# Altium schematic sheet Main.SchDoc
size A3; SheetNumber: 1; SheetTotal: 1
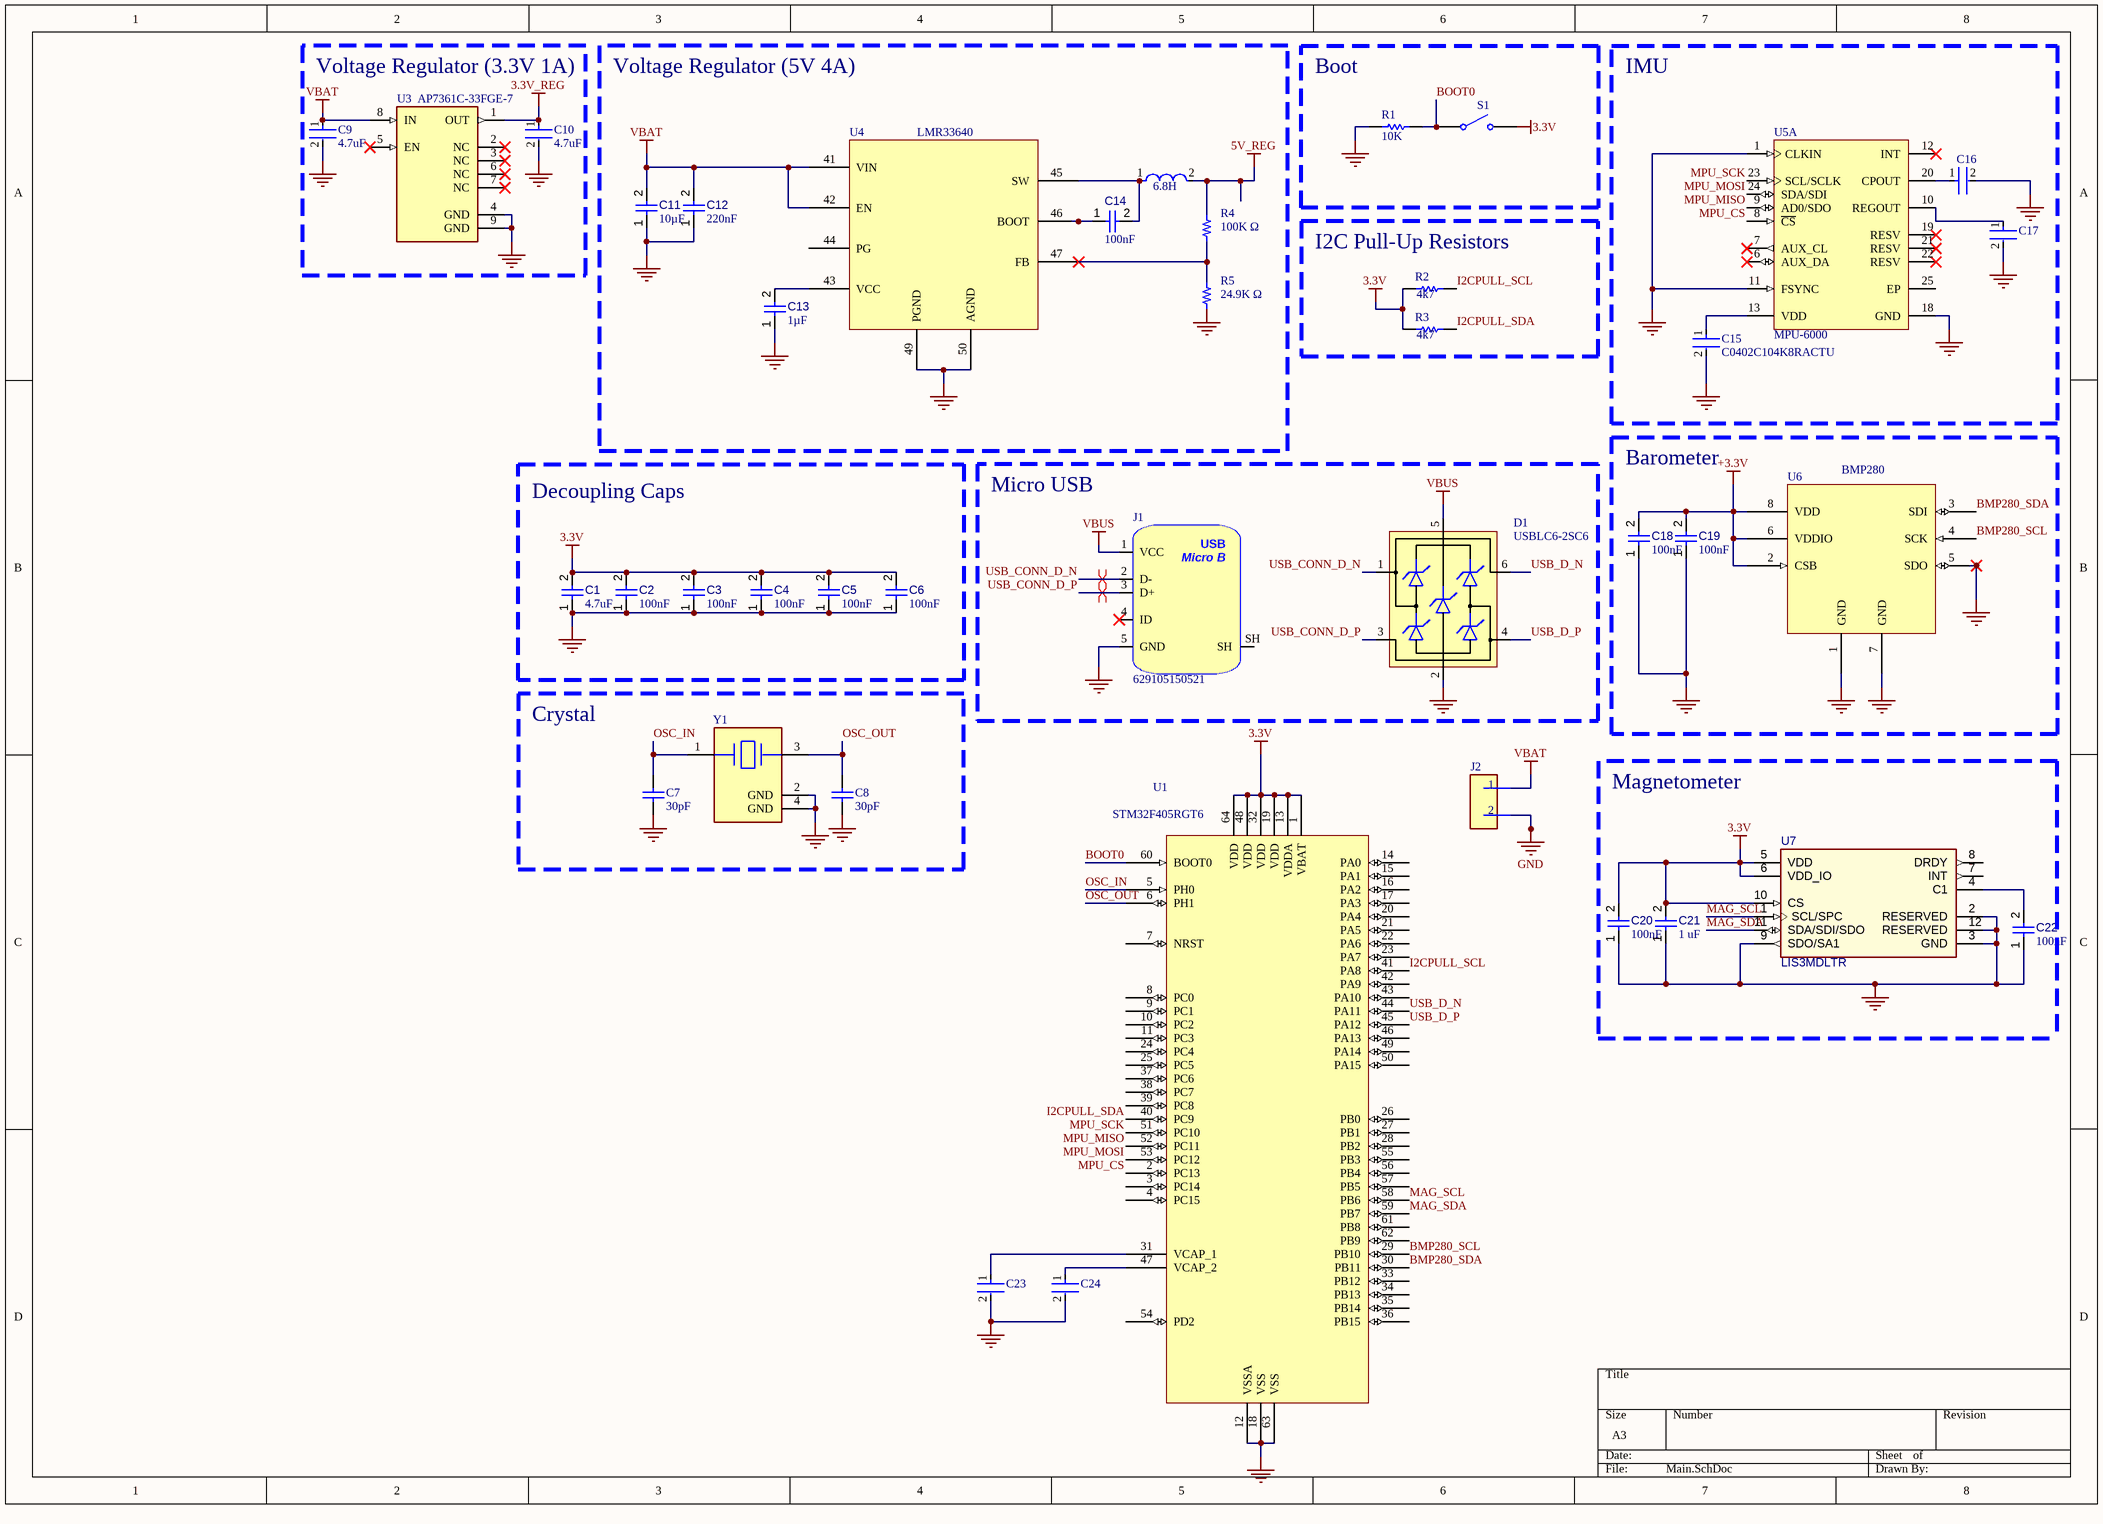
[diagram p0: Main.SchDoc]

## Parts
6.8H  IHLP4040DZER6R8M01  [FP-IHLP-4040DZ-FP_3_124x3-MFG]  (value not drawn)
C1  value 4.7uF  [CAPC1608X90X40NL10T20]  (hidden comment: Capacitor 100 nF +/-10% 50 V 0603)
C2  value 100nF  [CAPC2013X95X50LL10T25]  (hidden comment: Capacitor 100 nF +/-10% 50 V 0805)
C3  value 100nF  [CAPC2013X95X50LL10T25]  (hidden comment: Capacitor 100 nF +/-10% 50 V 0805)
C4  value 100nF  [CAPC2013X95X50LL10T25]  (hidden comment: Capacitor 100 nF +/-10% 50 V 0805)
C5  value 100nF  [CAPC2013X95X50LL10T25]  (hidden comment: Capacitor 100 nF +/-10% 50 V 0805)
C6  value 100nF  [CAPC2013X95X50LL10T25]  (hidden comment: Capacitor 100 nF +/-10% 50 V 0805)
C7  30pF  [CAPC1608X90X35NL10T15]
C8  30pF  [CAPC1608X90X35NL10T15]
C9  4.7uF  [FP-0805-L_2_01_0_2-W_1_25-IPC_A]
C10  4.7uF  [FP-0805-L_2_01_0_2-W_1_25-IPC_A]
C11  value 10µF  [CAPC0603(1608)100_L]  (hidden comment: Capacitor 10µF +/-20% 10V 0603)
C12  value 220nF  [CAPC0402(1005)60_L]  (hidden comment: Capacitor 220nF +/-20% 10V 0402)
C13  value 1µF  [CAPC1608X90X35ML15T15]  (hidden comment: Capacitor 1uF +/- 10% 16V 0603)
C14  value 100nF  [CAPC1005X56X25LL10T15]  (hidden comment: Capacitor 0.1 uF +/- 5% 16 V 0402)
C15  C0402C104K8RACTU  [FP-C0402-BB-MFG]
C16  06035C222KAT2A  [FP-0603-L_1_6_0_15-W_0_81-IPC_C]  (value not drawn)
C17  C0402C104K8RACTU  [FP-C0402-BB-MFG]  (value not drawn)
C18  value 100nF  [CAPC1005X56X25LL10T15]  (hidden comment: Capacitor 0.1 uF +/- 5% 16 V 0402)
C19  value 100nF  [CAPC1005X56X25LL10T15]  (hidden comment: Capacitor 0.1 uF +/- 5% 16 V 0402)
C20  value 100nF  [CAPC1005X56X25LL10T15]  (hidden comment: Capacitor 0.1 uF +/- 5% 16 V 0402)
C21  value 1 uF  [CAPC1005X56X25LL10T15]  (hidden comment: Capacitor 0.1 uF +/- 5% 16 V 0402)
C22  value 100nF  [CAPC1005X56X25LL10T15]  (hidden comment: Capacitor 0.1 uF +/- 5% 16 V 0402)
C23  GCM21BR71A225KA37L  [FP-GCM21B-0_15-IPC_A]  (value not drawn)
C24  GCM21BR71A225KA37L  [FP-GCM21B-0_15-IPC_A]  (value not drawn)
D1  USBLC6-2SC6  [SOT-23-6]
J1  629105150521  [629105150521]
J2  PRT-10474  [FP-PRT-10474-MFG]  (value not drawn)
R1  value 10K  (hidden comment: Resistor)
R2  ERJ-P06J472V  [RESC2013X70X40LL20T20]  (value not drawn)
R3  ERJ-P06J472V  [RESC2013X70X40LL20T20]  (value not drawn)
R4  100K Ω
R5  24.9K Ω
S1  Single-Pole, Single-Throw Switch  (value not drawn)
U1  STM32F405RGT6
U3  AP7361C-33FGE-7  [FP-U-DFN3030-8_Type_E-MFG]
U4  LMR33640
U5  MPU-6000  [INSE-QFN-24_V]  (part A of 2)
U6  BMP280
U7  LIS3MDLTR  [STM-LGA-12]
Y1  ABM8-16.000MHZ-B2-T  [FP-ABM8-MFG]  (value not drawn)

## Blocks framed on the sheet
Voltage Regulator (3.3V 1A): C9 C10 U3
Voltage Regulator (5V 4A): 6.8H C11-C14 R4 R5 U4
Boot: R1 S1
IMU: C15-C17 U5
I2C Pull-Up Resistors: R2 R3
Barometer: C18 C19 U6
Decoupling Caps: C1-C6
Micro USB: D1 J1
Crystal: C7 C8 Y1

## Nets
3.3V: C1.2 C2.2 C3.2 C4.2 C5.2 C6.2 C20.2 C21.2 R2.1 R3.1 S1.2 U1.1(VBAT) U1.13(VDDA) U1.19(VDD) U1.32(VDD) U1.48(VDD) U1.64(VDD) U7.5(VDD) U7.6(VDD_IO) U7.10(CS)
3.3V_REG: C10.1 U3.1(OUT)
5V_REG: 6.8H.2
+3.3V: C18.2 C19.2 U6.2(CSB) U6.6(VDDIO) U6.8(VDD)
GND: C1.1 C2.1 C3.1 C4.1 C5.1 C6.1 C7.1 C8.1 C9.2 C10.2 C11.1 C12.1 C13.1 C15.2 C16.2 C17.2 C18.1 C19.1 C20.1 C21.1 C22.1 C23.2 C24.2 D1.2(GND) J1.5(GND) R1.2 U1.12(VSSA) U1.18(VSS) U1.63(VSS) U3.4(GND) U3.9(GND) U4.49(PGND) U4.50(AGND) U5.1(CLKIN) U5.11(FSYNC) U5.18(GND) U6.1(GND) U6.5(SDO) U6.7(GND) U7.2(RESERVED) U7.3(GND) U7.9(SDO/SA1) U7.12(RESERVED) Y1.2(GND) Y1.4(GND)
VBAT: C9.1 C11.2 C12.2 U3.8(IN) U4.41(VIN) U4.42(EN)
VBUS: D1.5(VBUS) J1.1(VCC)
BMP280_SCL: U1.29(PB10) U6.4(SCK)
BMP280_SDA: U1.30(PB11) U6.3(SDI)
BOOT0: R1.1 S1.1 U1.60(BOOT0)
I2CPULL_SCL: R2.2 U1.41(PA8)
I2CPULL_SDA: R3.2 U1.40(PC9)
MAG_SCL: U1.58(PB6) U7.1(SCL/SPC)
MAG_SDA: U1.59(PB7) U7.11(SDA/SDI/SDO)
MPU_CS: U1.2(PC13) U5.8(~{CS})
MPU_MISO: U1.52(PC11) U5.9(AD0/SDO)
MPU_MOSI: U1.53(PC12) U5.24(SDA/SDI)
MPU_SCK: U1.51(PC10) U5.23(SCL/SCLK)
OSC_IN: C7.2 U1.5(PH0) Y1.1
OSC_OUT: C8.2 U1.6(PH1) Y1.3
USB_CONN_D_N: D1.1(IO1) J1.2(D-)
USB_CONN_D_P: D1.3(IO2) J1.3(D+)
USB_D_N: D1.6(IO1) U1.44(PA11)
USB_D_P: D1.4(IO2) U1.45(PA12)
Net6.8H_1: 6.8H.1 C14.2 U4.45(SW)
NetC13_2: C13.2 U4.43(VCC)
NetC14_1: C14.1 U4.46(BOOT)
NetC15_1: C15.1 U5.13(VDD)
NetC16_1: C16.1 U5.20(CPOUT)
NetC17_1: C17.1 U5.10(REGOUT)
NetC22_2: C22.2 U7.4(C1)
NetC23_1: C23.1 U1.31(VCAP_1)
NetC24_1: C24.1 U1.47(VCAP_2)

Not connected (* = marked no-connect by the designer): J1 4(ID)* SH; U1 3(PC14) 4(PC15) 7(NRST) 8(PC0) 9(PC1) 10(PC2) 11(PC3) 14(PA0) 15(PA1) 16(PA2) 17(PA3) 20(PA4) 21(PA5) 22(PA6) 23(PA7) 24(PC4) 25(PC5) 26(PB0) 27(PB1) 28(PB2) 33(PB12) 34(PB13) 35(PB14) 36(PB15) 37(PC6) 38(PC7) 39(PC8) 42(PA9) 43(PA10) 46(PA13) 49(PA14) 50(PA15) 54(PD2) 55(PB3) 56(PB4) 57(PB5) 61(PB8) 62(PB9); U3 2(NC)* 3(NC)* 5(EN)* 6(NC)* 7(NC)*; U4 44(PG) 47(FB)*; U5 6(AUX_DA)* 7(AUX_CL)* 12(INT)* 19(RESV)* 21(RESV)* 22(RESV)* 25(EP); U7 7(INT) 8(DRDY)

## Layout directives
differential pair; net class USB: USB_CONN_D_N, USB_CONN_D_P

## Notes on the sheet
- (near R2) 4k7
- (near R3) 4k7
- Magnetometer
- Labels drawn without touching a wire or pin: GND
- (in symbol 629105150521) USB; Micro B
- (in symbol CMP-157536-000001-1) 1; 2

## Library data of the parts
6.8H = CMP-02424-000228-1: Commercial Inductors, High Saturation Series 6.8uH 8A 23.3mΩ 20%; Saturation Current: 13.5A; Core Material: Metal; Shielding: Shielded; Self Resonant Frequency: 5MHz; Test Frequency: 100kHz; DC Resistance (DCR): 23.3mR; Current Rating: 8A; Contact Plating: Tin; Width: 0.405inch; RMS Current (Irms): 8A; Package Quantity: 500; Case/Package: 4040; Tolerance: 20%; Inductance Tolerance: 20%; Packaging: Tape and Reel; Max Operating Temperature: 125°C; Height - Seated (Max): 0.157inch; Termination: SMD/SMT; Length: 0.43inch; Inductance: 6.8uH; Max DC Current: 13.5A; Number of Pins: 4040; Min Operating Temperature: -55°C; Lead Free: Lead Free; Height: 4mm; Radiation Hardening: No; Military Standard: Not; Mount: Surface Mount; Depth: 10.3mm
C1 = CMP-001-00017-6: Chip Capacitor, 100 nF, +/- 10%, 50 V, 0603 (1608 Metric); Voltage Rating: 50V; Capacitor Type: Ceramic; Tolerance: 10%; Mounting Technology: SM; Max Operating Temperature: 125°C; RoHS Compliant: True; Pins: 2; Case/Package: 0603; Min Operating Temperature: -55°C
C2-C6 = CMP-001-00018-6: Chip Capacitor, 100 nF, +/- 10%, 50 V, 0805 (2012 Metric); Capacitor Type: Ceramic; Voltage Rating: 50V; Pins: 2; Max Operating Temperature: 125°C; Min Operating Temperature: -55°C; Mounting Technology: SM; Case/Package: 0805; RoHS Compliant: True; Tolerance: 10%
C7 C8 = CMP-2006-02652-1: GRM1885C1H300JA01D; Manufacturer: Murata; Part Number: GRM1885C1H300JA01D
C9 C10 = CMP-2007-04667-2: General Purpose Ceramic Capacitor, 0805, 4.7uF, 10%, X5R, 15%, 16V; Voltage Rating (DC): 16V; Dielectric: X5R; Series: -; Length: 2.01mm; Height: 1.4mm; Case Code (Imperial): 0805; Lead Free: Lead Free; Thickness: 0.055inch; Min Operating Temperature: -55°C; Contact Plating: Tin; Max Operating Temperature: 85°C; Package Quantity: 1; Mount: Surface Mount; REACH SVHC: No SVHC; RoHS Compliant: Yes; Number of Pins: 2; Case Code (Metric): 2012; Voltage Rating: 16V; Tolerance: 10%; Termination: SMD/SMT; Construction: Flat; Case/Package: 0805; Radiation Hardening: No; Width: 0.049inch; Depth: 1.25mm; Capacitance: 4.7uF; Packaging: Tape and Reel
C11 = CMP-001-00075-4: Chip Capacitor, 10µF +/-20%, 10V, 0603, Thickness 1 mm; Tolerance: 10%; Voltage Rating: 10V; Max Operating Temperature: 85°C; Pins: 2; Case/Package: 0603; Mounting Technology: SMT; Min Operating Temperature: -55°C
C12 = CMP-001-00057-3: Chip Capacitor, 220nF +/-20%, 10V, 0402, Thickness 0.6 mm; Tolerance: 10%; Max Operating Temperature: 85°C; Pins: 2; Case/Package: 0402; Mounting Technology: SMT; Voltage Rating: 10V; Min Operating Temperature: -55°C
C13 = CMP-001-00004-6: Chip Capacitor, 1 uF, +/- 10%, 16 V, 0603 (1608 Metric); Capacitor Type: Ceramic; Mounting Technology: SM; RoHS Compliant: True; Min Operating Temperature: -55°C; Case/Package: 0603; Pins: 2; Voltage Rating: 16V; Max Operating Temperature: 125°C; Tolerance: 10%
C14 = CMP-001-00001-6: Chip Capacitor, 0.1 uF, +/- 5%, 16 V, 0402 (1005 Metric); Capacitor Type: Ceramic; Voltage Rating: 16V; Max Operating Temperature: 125°C; Min Operating Temperature: -55°C; Case/Package: 0402; Mounting Technology: SM; Pins: 2; Tolerance: 5%; RoHS Compliant: True
C15 C17 = CMP-2008-03086-2: CAP CER 0.1UF 10V X7R 0402; Manufacturer: Kemet; Capacitance: 0.10 μF; Tolerance: 0.1; Temperature Coefficient: 15%; Value: 0.10 μF; Material: Ceramic; Automotive: No; Temperature Range High: +125°C; Octopart: https://octopart.com/c0402c104k8ractu-kemet-106349; ComponentLink2Description: Datasheet; ComponentLink2URL: https://content.kemet.com/datasheets/KEM_C1002_X7R_SMD.pdf; Temperature: -55°C to +125°C; RoHS: TRUE; Temperature Range Low: -55°C; Temperature Characteristic: X7R; Lead Free: Yes; Height: 0.55mm; Manufacturer Part Number: C0402C104K8RACTU; Voltage Rating: 10 V; Category: Cap; Device Class L3: Ceramic Capacitors; Digikey Description: CAP CER 0.1UF 10V X7R 0402; Package: C0402-BB; Device Class L1: Passive Components; Ipc Land Pattern Name: CAPC10050X50; Mouser Description: Multilayer Ceramic Capacitors MLCC - SMD/SMT 10volts 0.1uF X7R 10%; Device Class L2: Capacitors
C16 = CMP-2006-04409-2: General Purpose Ceramic Capacitor, 0603, 2.2nF, 10%, X7R, 15%, 50V; Dissipation Factor: 2.5%; Voltage: 25V; Thickness: 0.035inch; Series: -; Package Quantity: 1; Case Code (Metric): 1608; Capacitance: 2.2nF; Max Operating Temperature: 125°C; Mount: Surface Mount; Width: 0.032inch; Dielectric Material: Ceramic; Case/Package: 0603; Number of Pins: 2; Dielectric: X7R; Termination: SMD/SMT; Tolerance: 10%; Construction: Flat; Min Operating Temperature: -55°C; Depth: 0.81mm; Radiation Hardening: No; Voltage Rating: 50V; Case Code (Imperial): 0603; Contact Plating: Tin; Length: 1.6mm; Packaging: Tape and Reel; Voltage Rating (DC): 50V; Lead Free: Lead Free; REACH SVHC: No SVHC; RoHS Compliant: Yes; Height: 0.9mm
C18-C20 C22 = CMP-001-00001-6: Ceramic, X7R, +-10%, 2V; Voltage Rating: 16V; Max Operating Temperature: 125°C; Min Operating Temperature: -55°C; Capacitor Type: Ceramic; Case/Package: 0402; Mounting Technology: SM; Pins: 2; Tolerance: 5%; RoHS Compliant: True
C21 = CMP-001-00001-6: Electrolytic Cap; Capacitor Type: Ceramic; Voltage Rating: 16V; Max Operating Temperature: 125°C; Min Operating Temperature: -55°C; Case/Package: 0402; Mounting Technology: SM; Pins: 2; Tolerance: 5%; RoHS Compliant: True
C23 C24 = CMP-2007-03336-2: Ceramic Capacitor for Automotive 2.2uF ±10% 10VDC X7R 0805 Embossed T/R; Voltage Rating (DC): 10V; Radiation Hardening: No; Case/Package: 0805; Packaging: Tape and Reel; Mount: Surface Mount; Height: 1.25mm; Min Operating Temperature: -55°C; Dielectric: X7R; Thickness: 0.055inch; Voltage Rating: 10V; Capacitance: 2.2uF; Length: 2mm; Width: 1.25mm; Tolerance: 10%; Depth: 1.25mm; Ratings: AEC-Q200; Package Quantity: 3000; Case Code (Imperial): 0805; Voltage: 10V; Max Operating Temperature: 125°C; Termination: SMD/SMT; Case Code (Metric): 2012
D1 = USBLC6-2SC6: Low-Capacitance ESD Protection USB; Manufacturer: STMicroelectronics; Manufacturer Part Number: USBLC6-2SC6; Distributor Link: https://www.mouser.de/ProductDetail/STMicroelectronics/USBLC6-2SC6?qs=po45yt2pPpu%2FhNIlwQdTlg%3D%3D
J1 = 629105150521: USB Connector Type Micro B 2.0 SMD; Manufacturer: Wurth; Manufacturer Part Number: 629105150521; Distributor Link: https://www.mouser.de/ProductDetail/Wurth-Elektronik/629105150521?qs=a9WhcLg8qCzXiH7kZP8GRQ%3D%3D
J2 = CMP-157536-000001-1: XT60 CONNECTORS MALE/FEMALE PAIR
R1 = Resistor: TC1: 0; SimulationGenericComponent: True; TC2: 0
R2 R3 = CMP-2001-00487-1: Manufacturer: Panasonic; Part Number: ERJ-P06J472V
R4 R5 = RCS0603100KFKEA
S1 = SPST SW: closed: 0; Rclosed: 1m; Ropen: 1Meg; SimulationGenericComponent: True
U1 = STM32F405RGT6: MCU
U3 = CMP-12756-000002-1: IC REG LINEAR 3.3V 1A UDFN3030-8; Manufacturer: Diodes Inc.; Standoff Height: 0mm; Nominal Supply Current: 60uA; Number Of Outputs: 1; Max Junction Temp: +150°C; Output Type: Fixed; Dropout Voltage: 840mV; Min Supply Voltage: 2.2V; Max Power Dissipation: 1700mW; Accuracy Percentage: 1%; Max Supply Voltage: 6V; Ipc Land Pattern Name: DFN300X300X60-8; Footprint Url: https://www.diodes.com/assets/Package-Files/U-DFN3030-8-Type-E.pdf; Output Voltage: 3.3V; Manufacturer Part Number: AP7361C-33FGE-7; Device Class L3: Voltage Regulators - Linear; Temperature: -40°C to +150°C; Temperature Range High: +150°C; Mouser Description: LDO Voltage Regulators 1A LDO Reg w/Enable 3.3V 6.5Vin 1700mW; Height: 0.63mm; Ambient Temperature Range High: +85°C; ComponentLink2Description: Datasheet; Automotive: No; Output Current: 1A; Octopart: https://octopart.com/ap7361c-33fge-7-diodes+inc.-65869522; Package: U-DFN3030-8 (Type E); Digikey Description: IC REG LINEAR 3.3V 1A UDFN3030-8; Lead Free: Yes; Category: IC; Device Class L1: Integrated Circuits (ICs); Ambient Temperature Range Low: -40°C; Device Class L2: Power Management ICs; RoHS: TRUE; Temperature Range Low: -40°C; ComponentLink2URL: https://www.diodes.com/assets/Datasheets/AP7361C.pdf
U5 = CMP-2000-05008-1: 3-Axis Gyroscope 3-Axis Accelerometer Motion Processing Unit with I2C and SPI, 2.5, 3 or 3.3 V, -40 to 85 degC, 24-Pin QFN, RoHS, Tape and Reel; Manufacturer: InvenSense; Featured Product: MPU60006AxisIntegratedSPISolution; Output Type: I²C,SPI; Sensor Type: Accelerometer,Gyroscope,3Axis; Other Names: 1428-1005-2 / MPU6000; Online Catalog: MPU-6000™Series; Operating Temperature: -40degC~85degC(TA); Datasheet URL: https://www.invensense.com/wp-content/uploads/2015/02/MPU-6000-Datasheet1.pdf; Manufacturer URL: http://www.invensense.com/; Datasheet Version: Rev. 3.4, 08/2013; Standard Package: 5,000; Family: Multifunction; Package Reference: QFN-24; Category: Sensors,Transducers; Package Description: 24-Pin Quad Flat No-lead Package, Body 4 x 4 mm, Pitch 0.5 mm
U7 = CMP-010-00019-3: Digital Output Magnetic Sensor, 1.9 to 3.6 V, -40 to 85 degC, 12-Pin LGA, RoHS, Tape and Reel; Max Supply Voltage: 3.6V; Min Supply Voltage: 1.9V; Sensor Type: Magnetometer; Min Operating Temperature: -40°C; RoHS Compliant: Yes; Mounting Technology: SMT; Case/Package: LGA-12; Max Operating Temperature: 85°C; Pins: 12
Y1 = CMP-27762-006167-1: Crystal 16MHz ±20ppm 18pF SMD-4 3.2mm x 2.5mm; Series Resistance: 70R; Frequency Stability: 50ppm; Tolerance: 20ppm; Number of Pins: 4; Max Operating Temperature: 70°C; Operating Frequency: 16 MHz; Height: 0.031inch; REACH SVHC: No SVHC; Frequency: 16MHz; Depth: 2.5mm; Package Quantity: 1000; Series: ABM8; Termination: SMD/SMT; Load Capacitance: 18pF; Frequency Tolerance: 20ppm; Min Operating Temperature: -20°C; Length: 3.2mm; ESR (Equivalent Series Resistance): 70R; Width: 2.5mm; Lead Free: Lead Free; Resistor Type: Ceramic; Radiation Hardening: No; Mount: Surface Mount; RoHS Compliant: Yes; Case/Package: CSMD; Packaging: Tape and Reel